# Altium schematic sheet Supply Sources Group.SchDoc
size 420 x 297 mm; Author: ALTIUM GOSTBOM2.0 KEV; SheetNumber: 32; SheetTotal: 48
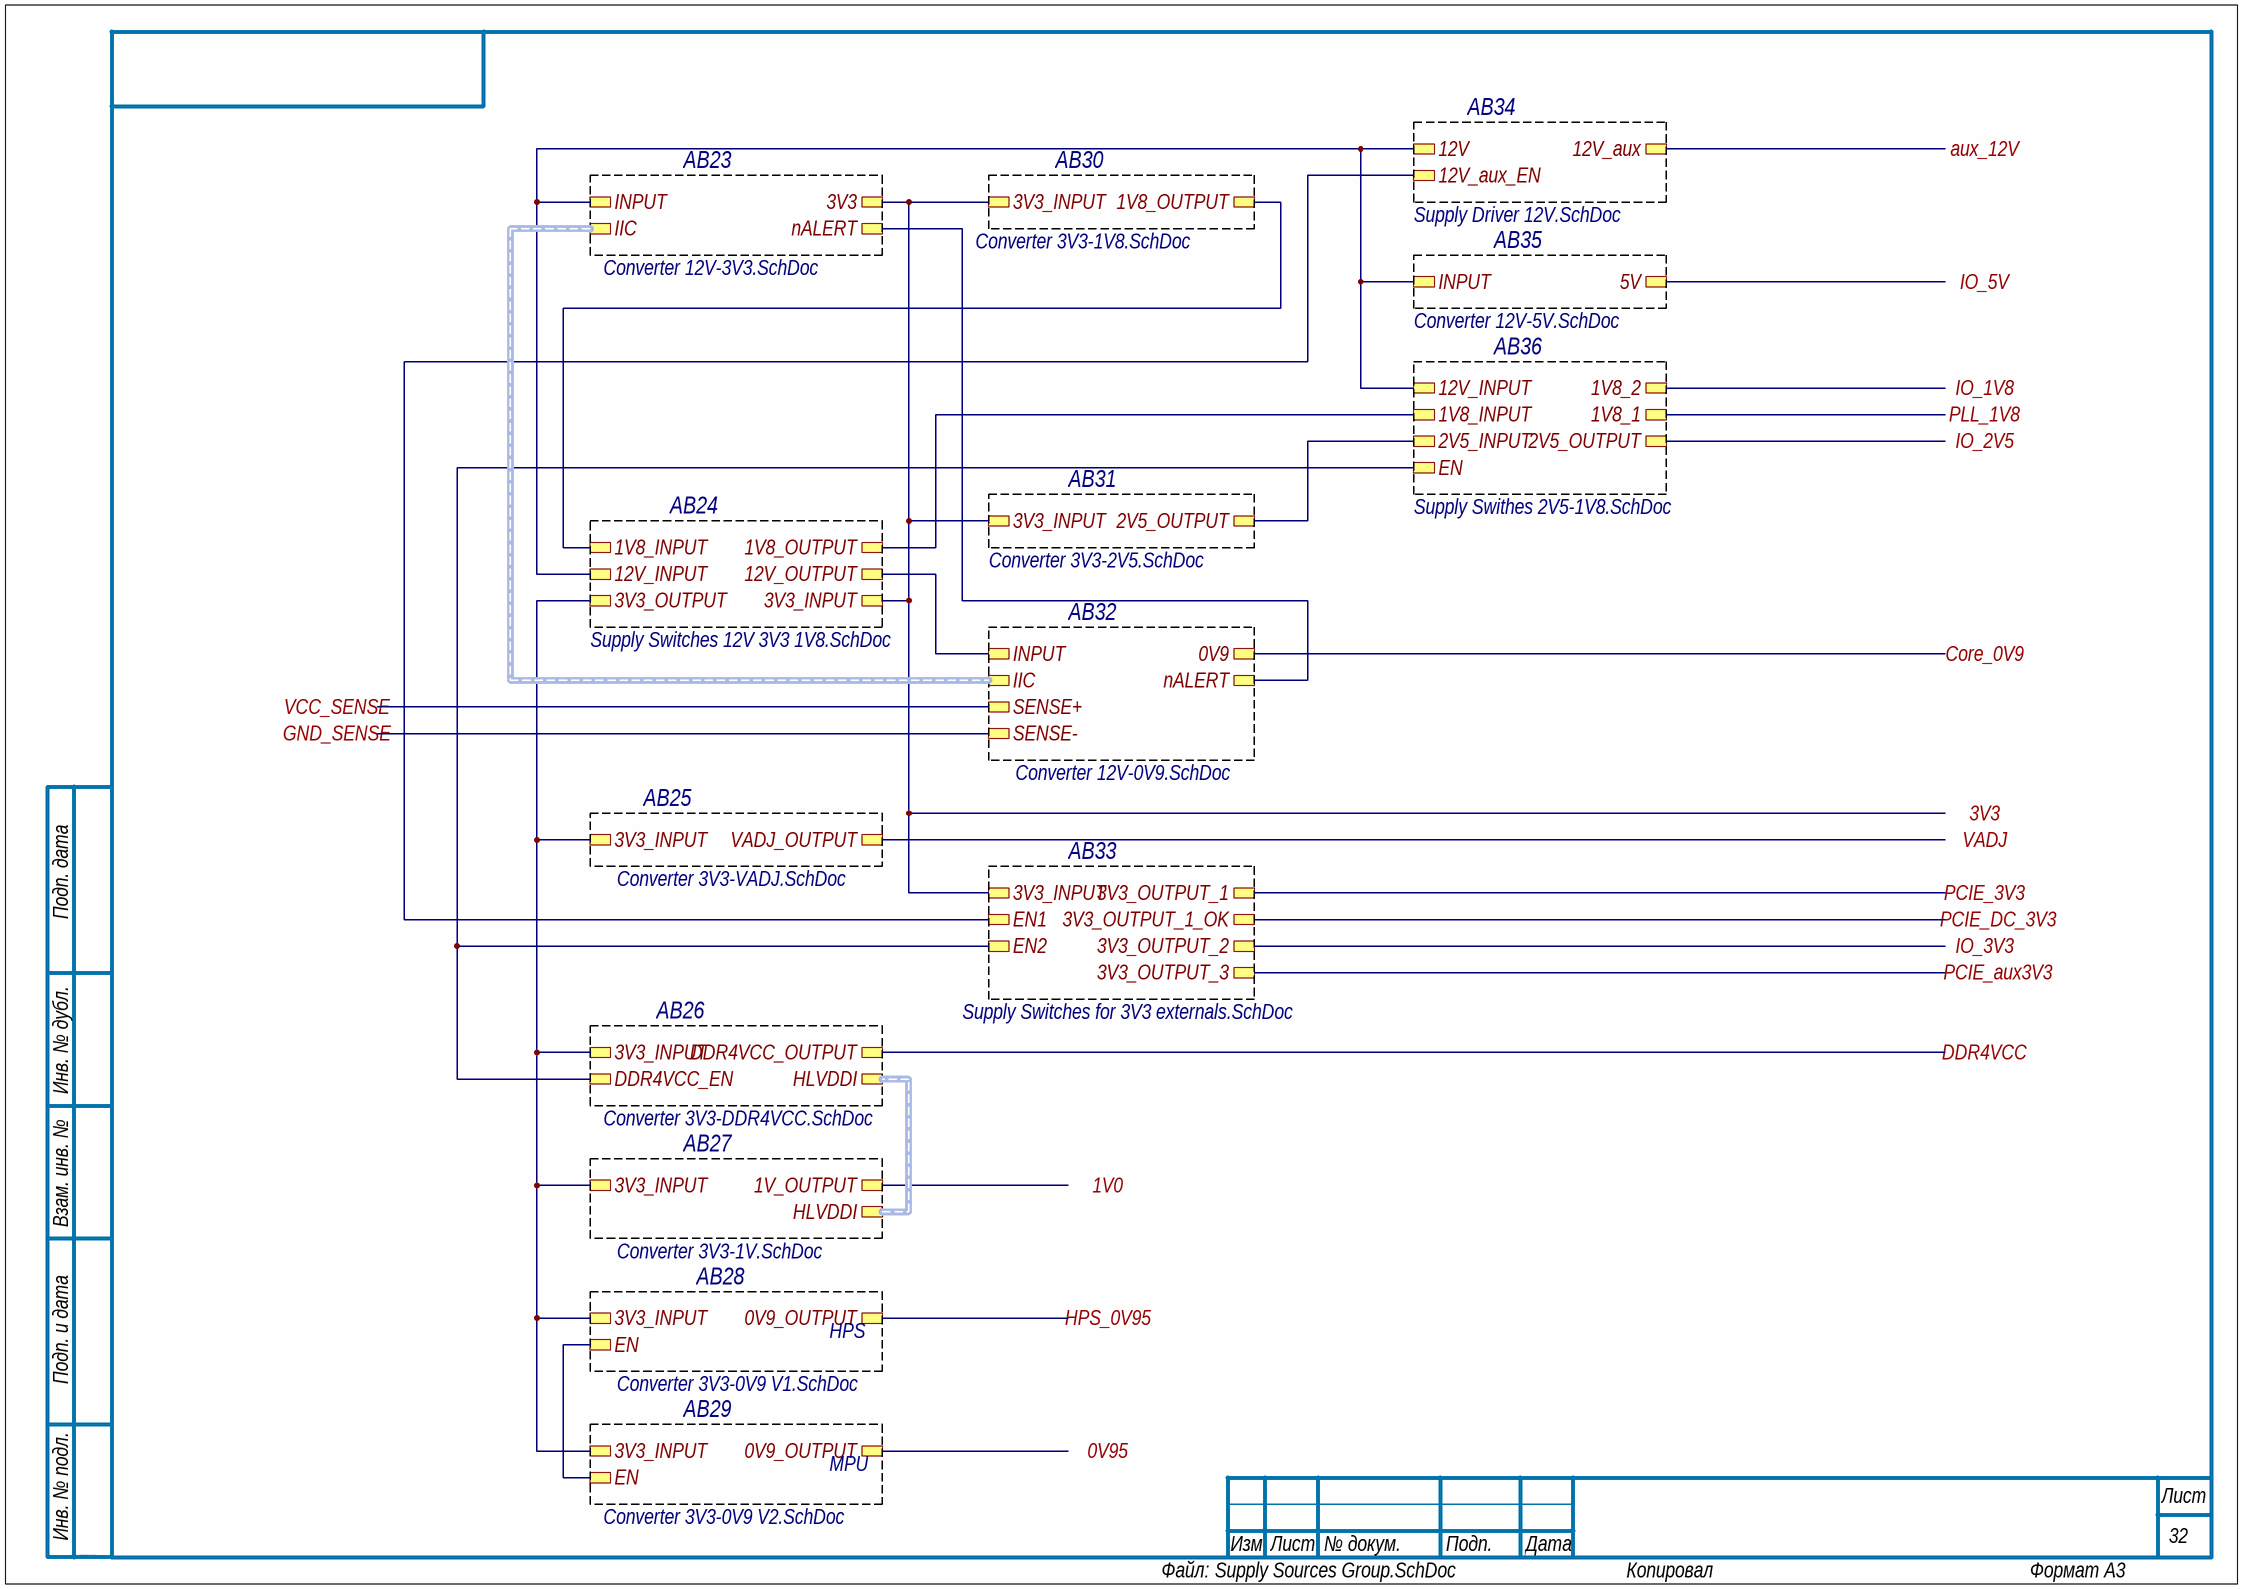
[diagram p0: Supply Sources Group.SchDoc]

## Sub-sheets
AB23 = Converter 12V-3V3.SchDoc: IIC (harness IIC), INPUT, 3V3, nALERT
AB24 = Supply Switches 12V 3V3 1V8.SchDoc: 12V_INPUT, 3V3_INPUT, 3V3_OUTPUT, 12V_OUTPUT, 1V8_OUTPUT, 1V8_INPUT
AB25 = Converter 3V3-VADJ.SchDoc: 3V3_INPUT, VADJ_OUTPUT
AB26 = Converter 3V3-DDR4VCC.SchDoc: HLVDDI (harness DIFFPAIR), DDR4VCC_OUTPUT, 3V3_INPUT, DDR4VCC_EN
AB27 = Converter 3V3-1V.SchDoc: HLVDDI (harness DIFFPAIR), 1V_OUTPUT, 3V3_INPUT
AB28 = Converter 3V3-0V9 V1.SchDoc: 3V3_INPUT, 0V9_OUTPUT, EN  | Load: HPS
AB29 = Converter 3V3-0V9 V2.SchDoc: 3V3_INPUT, EN, 0V9_OUTPUT  | Load: MPU
AB30 = Converter 3V3-1V8.SchDoc: 1V8_OUTPUT, 3V3_INPUT
AB31 = Converter 3V3-2V5.SchDoc: 2V5_OUTPUT, 3V3_INPUT
AB32 = Converter 12V-0V9.SchDoc: IIC (harness IIC), 0V9, nALERT, INPUT, SENSE-, SENSE+
AB33 = Supply Switches for 3V3 externals.SchDoc: 3V3_OUTPUT_2, 3V3_OUTPUT_1_OK, 3V3_OUTPUT_3, EN1, 3V3_INPUT, 3V3_OUTPUT_1, EN2
AB34 = Supply Driver 12V.SchDoc: 12V_aux_EN, 12V, 12V_aux
AB35 = Converter 12V-5V.SchDoc: INPUT, 5V
AB36 = Supply Swithes 2V5-1V8.SchDoc: EN, 12V_INPUT, 2V5_INPUT, 2V5_OUTPUT, 1V8_1, 1V8_2, 1V8_INPUT

## Ports
0V95, 1V0, 3V3, aux_12V, Core_0V9, DDR4VCC, GND_SENSE, HPS_0V95, IO_1V8, IO_2V5, IO_3V3, IO_5V, PCIE_3V3, PCIE_aux3V3, PCIE_DC_3V3, PLL_1V8, VADJ, VCC_SENSE

## Nets
0V95: port 0V95, sheet AB29/0V9_OUTPUT
1V0: port 1V0, sheet AB27/1V_OUTPUT
3V3: port 3V3, sheet AB23/3V3, sheet AB24/3V3_INPUT, sheet AB30/3V3_INPUT, sheet AB31/3V3_INPUT, sheet AB33/3V3_INPUT
aux_12V: port aux_12V, sheet AB34/12V_aux
Core_0V9: port Core_0V9, sheet AB32/0V9
DDR4VCC: port DDR4VCC, sheet AB26/DDR4VCC_OUTPUT
GND_SENSE: port GND_SENSE, sheet AB32/SENSE-
HPS_0V95: port HPS_0V95, sheet AB28/0V9_OUTPUT
IO_1V8: port IO_1V8, sheet AB36/1V8_2
IO_2V5: port IO_2V5, sheet AB36/2V5_OUTPUT
IO_3V3: port IO_3V3, sheet AB33/3V3_OUTPUT_2
IO_5V: port IO_5V, sheet AB35/5V
PCIE_3V3: port PCIE_3V3, sheet AB33/3V3_OUTPUT_1
PCIE_aux3V3: port PCIE_aux3V3, sheet AB33/3V3_OUTPUT_3
PCIE_DC_3V3: port PCIE_DC_3V3, sheet AB33/3V3_OUTPUT_1_OK
PLL_1V8: port PLL_1V8, sheet AB36/1V8_1
VADJ: port VADJ, sheet AB25/VADJ_OUTPUT
VCC_SENSE: port VCC_SENSE, sheet AB32/SENSE+
(unnamed): sheet AB23/INPUT, sheet AB35/INPUT, sheet AB24/12V_INPUT, sheet AB34/12V, sheet AB36/12V_INPUT
(unnamed): sheet AB23/nALERT, sheet AB32/nALERT
(unnamed): sheet AB32/INPUT, sheet AB24/12V_OUTPUT
(unnamed): sheet AB24/3V3_OUTPUT, sheet AB28/3V3_INPUT, sheet AB27/3V3_INPUT, sheet AB25/3V3_INPUT, sheet AB26/3V3_INPUT, sheet AB29/3V3_INPUT
(unnamed): sheet AB24/1V8_OUTPUT, sheet AB36/1V8_INPUT
(unnamed): sheet AB24/1V8_INPUT, sheet AB30/1V8_OUTPUT
(unnamed): sheet AB34/12V_aux_EN, sheet AB33/EN1
(unnamed): sheet AB36/EN, sheet AB26/DDR4VCC_EN, sheet AB33/EN2
(unnamed): sheet AB36/2V5_INPUT, sheet AB31/2V5_OUTPUT
(unnamed): sheet AB28/EN, sheet AB29/EN

## Buses and harness runs
harness sheet AB23/IIC = sheet AB32/IIC
harness sheet AB26/HLVDDI = sheet AB27/HLVDDI

## Notes on the sheet
- Подп. дата
- Инв. № дубл.
- Взам. инв. №
- Подп. и дата
- Инв. № подл.
- Изм.
- Лист
- № докум.
- Подп.
- Дата
- ALTIUM GOSTBOM2.0 KEV
- Файл:
- Копировал
- Формат А3